# Altium schematic sheet LPDDR4.SchDoc: LPDDR4
size A3; Date: Not used; ApprovedBy: Not used; CheckedBy: Not used; Author: Not used; CompanyName: STMicroelectronics; DrawnBy: Not used; Engineer: Not used; Organization: Not used; Address1: Not used; Address2: Not used; Address3: Not used; Address4: Not used; DocumentNumber: Not used; Revision: Not used; SheetNumber: 6; SheetTotal: 7; CurrentTime: Not used; CurrentDate: Not used; Time: Not used; DocumentFullPathAndName: Not used; DocumentName: Not used; ModifiedDate: Not used; ImagePath: Not used; ProjectName: Not used; Application_BuildNumber: Not used
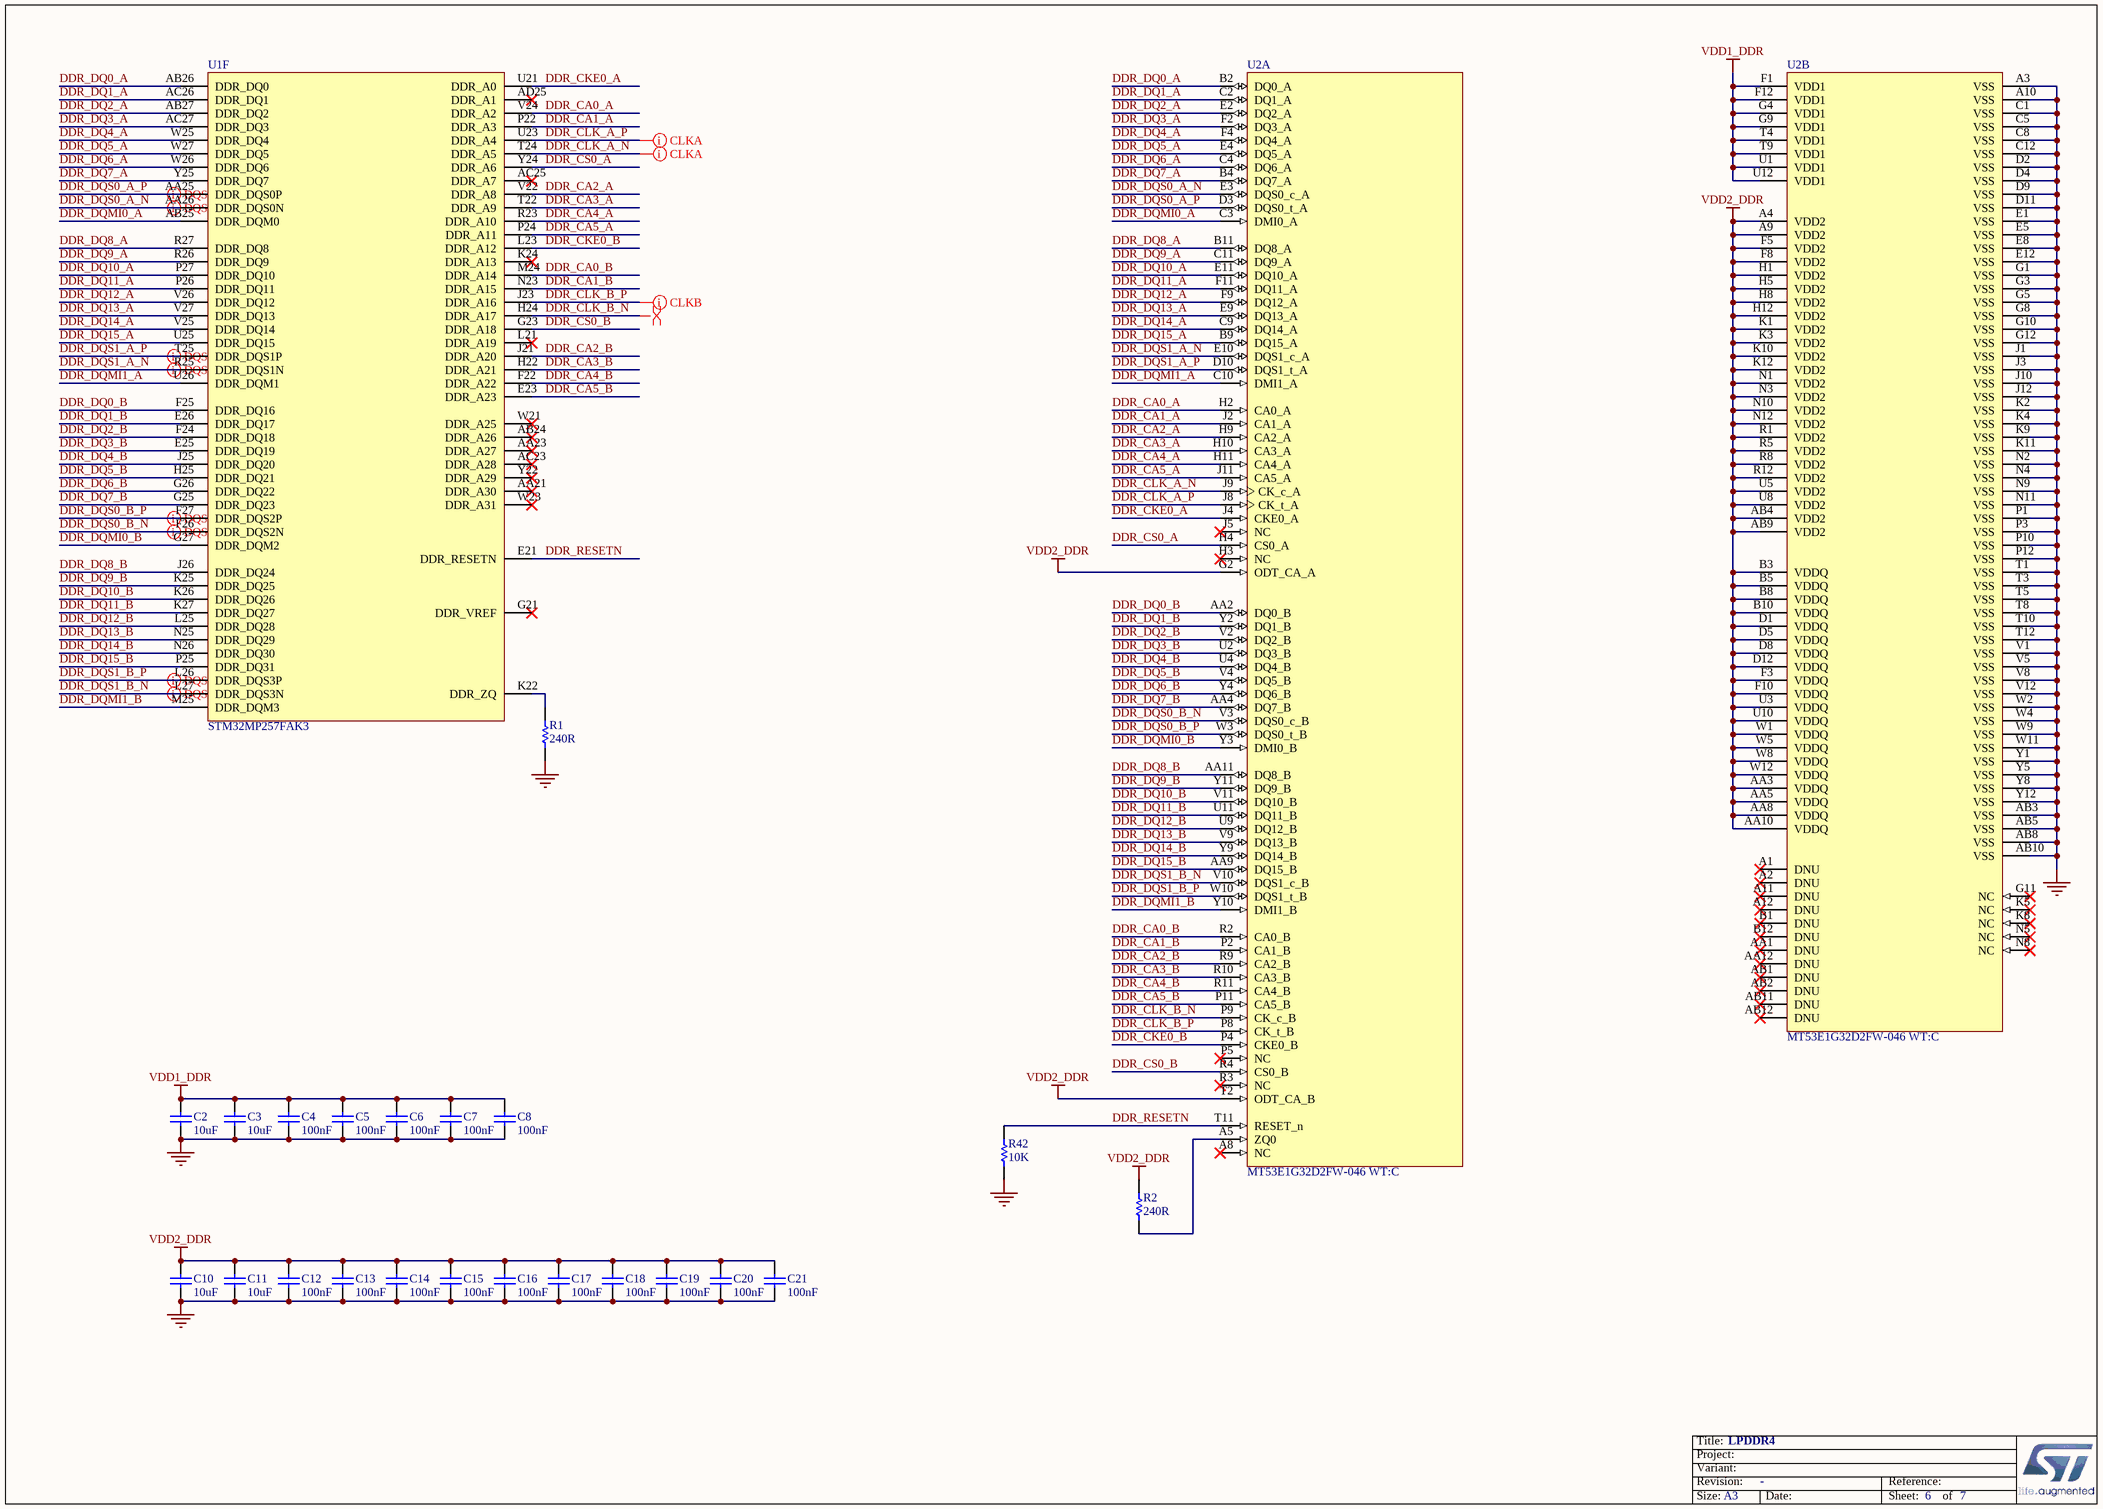
[diagram p0: LPDDR4.SchDoc]

## Parts
C2  value 10uF  [C0603]  (hidden comment: Capacitor)
C3  value 10uF  [C0603]  (hidden comment: Capacitor)
C4  100nF  [C0402]
C5  100nF  [C0402]
C6  100nF  [C0402]
C7  100nF  [C0402]
C8  100nF  [C0402]
C10  value 10uF  [C0603]  (hidden comment: Capacitor)
C11  value 10uF  [C0603]  (hidden comment: Capacitor)
C12  100nF  [C0402]
C13  100nF  [C0402]
C14  100nF  [C0402]
C15  100nF  [C0402]
C16  100nF  [C0402]
C17  100nF  [C0402]
C18  100nF  [C0402]
C19  100nF  [C0402]
C20  100nF  [C0402]
C21  100nF  [C0402]
R1  value 240R  [R0201_H0P23]  (hidden comment: Resistor)
R2  value 240R  [R0201_H0P23]  (hidden comment: Resistor)
R42  value 10K  [R0402]  (hidden comment: Resistor)
U1  STM32MP257FAK3  [ICC_TFBGA424_14X14_P050_H1P20_CODE-B0A2]  (part F of 9)
U2  MT53E1G32D2FW-046 WT:C  [ICC_TFBGA200_10X14P5_P080_H1P05_PS0P3]  (parts A,B of 2)

## Nets
GND: C2.1 C3.1 C4.2 C5.2 C6.2 C7.2 C8.2 C10.1 C11.1 C12.2 C13.2 C14.2 C15.2 C16.2 C17.2 C18.2 C19.2 C20.2 C21.2 R1.1 R42.1 U2.A3(VSS) U2.A10(VSS) U2.AB3(VSS) U2.AB5(VSS) U2.AB8(VSS) U2.AB10(VSS) U2.C1(VSS) U2.C5(VSS) U2.C8(VSS) U2.C12(VSS) U2.D2(VSS) U2.D4(VSS) U2.D9(VSS) U2.D11(VSS) U2.E1(VSS) U2.E5(VSS) U2.E8(VSS) U2.E12(VSS) U2.G1(VSS) U2.G3(VSS) U2.G5(VSS) U2.G8(VSS) U2.G10(VSS) U2.G12(VSS) U2.J1(VSS) U2.J3(VSS) U2.J10(VSS) U2.J12(VSS) U2.K2(VSS) U2.K4(VSS) U2.K9(VSS) U2.K11(VSS) U2.N2(VSS) U2.N4(VSS) U2.N9(VSS) U2.N11(VSS) U2.P1(VSS) U2.P3(VSS) U2.P10(VSS) U2.P12(VSS) U2.T1(VSS) U2.T3(VSS) U2.T5(VSS) U2.T8(VSS) U2.T10(VSS) U2.T12(VSS) U2.V1(VSS) U2.V5(VSS) U2.V8(VSS) U2.V12(VSS) U2.W2(VSS) U2.W4(VSS) U2.W9(VSS) U2.W11(VSS) U2.Y1(VSS) U2.Y5(VSS) U2.Y8(VSS) U2.Y12(VSS)
VDD1_DDR: C2.2 C3.2 C4.1 C5.1 C6.1 C7.1 C8.1 U2.F1(VDD1) U2.F12(VDD1) U2.G4(VDD1) U2.G9(VDD1) U2.T4(VDD1) U2.T9(VDD1) U2.U1(VDD1) U2.U12(VDD1)
VDD2_DDR: C10.2 C11.2 C12.1 C13.1 C14.1 C15.1 C16.1 C17.1 C18.1 C19.1 C20.1 C21.1 R2.2 U2.A4(VDD2) U2.A9(VDD2) U2.AA3(VDDQ) U2.AA5(VDDQ) U2.AA8(VDDQ) U2.AA10(VDDQ) U2.AB4(VDD2) U2.AB9(VDD2) U2.B3(VDDQ) U2.B5(VDDQ) U2.B8(VDDQ) U2.B10(VDDQ) U2.D1(VDDQ) U2.D5(VDDQ) U2.D8(VDDQ) U2.D12(VDDQ) U2.F3(VDDQ) U2.F5(VDD2) U2.F8(VDD2) U2.F10(VDDQ) U2.G2(ODT_CA_A) U2.H1(VDD2) U2.H5(VDD2) U2.H8(VDD2) U2.H12(VDD2) U2.K1(VDD2) U2.K3(VDD2) U2.K10(VDD2) U2.K12(VDD2) U2.N1(VDD2) U2.N3(VDD2) U2.N10(VDD2) U2.N12(VDD2) U2.R1(VDD2) U2.R5(VDD2) U2.R8(VDD2) U2.R12(VDD2) U2.T2(ODT_CA_B) U2.U3(VDDQ) U2.U5(VDD2) U2.U8(VDD2) U2.U10(VDDQ) U2.W1(VDDQ) U2.W5(VDDQ) U2.W8(VDDQ) U2.W12(VDDQ)
DDR_CA0_A: U1.V24(DDR_A2) U2.H2(CA0_A)
DDR_CA0_B: U1.M24(DDR_A14) U2.R2(CA0_B)
DDR_CA1_A: U1.P22(DDR_A3) U2.J2(CA1_A)
DDR_CA1_B: U1.N23(DDR_A15) U2.P2(CA1_B)
DDR_CA2_A: U1.V22(DDR_A8) U2.H9(CA2_A)
DDR_CA2_B: U1.J21(DDR_A20) U2.R9(CA2_B)
DDR_CA3_A: U1.T22(DDR_A9) U2.H10(CA3_A)
DDR_CA3_B: U1.H22(DDR_A21) U2.R10(CA3_B)
DDR_CA4_A: U1.R23(DDR_A10) U2.H11(CA4_A)
DDR_CA4_B: U1.F22(DDR_A22) U2.R11(CA4_B)
DDR_CA5_A: U1.P24(DDR_A11) U2.J11(CA5_A)
DDR_CA5_B: U1.E23(DDR_A23) U2.P11(CA5_B)
DDR_CKE0_A: U1.U21(DDR_A0) U2.J4(CKE0_A)
DDR_CKE0_B: U1.L23(DDR_A12) U2.P4(CKE0_B)
DDR_CLK_A_N: U1.T24(DDR_A5) U2.J9(CK_c_A)
DDR_CLK_A_P: U1.U23(DDR_A4) U2.J8(CK_t_A)
DDR_CLK_B_N: U1.H24(DDR_A17) U2.P9(CK_c_B)
DDR_CLK_B_P: U1.J23(DDR_A16) U2.P8(CK_t_B)
DDR_CS0_A: U1.Y24(DDR_A6) U2.H4(CS0_A)
DDR_CS0_B: U1.G23(DDR_A18) U2.R4(CS0_B)
DDR_DQ0_A: U1.AB26(DDR_DQ0) U2.B2(DQ0_A)
DDR_DQ0_B: U1.F25(DDR_DQ16) U2.AA2(DQ0_B)
DDR_DQ1_A: U1.AC26(DDR_DQ1) U2.C2(DQ1_A)
DDR_DQ1_B: U1.E26(DDR_DQ17) U2.Y2(DQ1_B)
DDR_DQ2_A: U1.AB27(DDR_DQ2) U2.E2(DQ2_A)
DDR_DQ2_B: U1.F24(DDR_DQ18) U2.V2(DQ2_B)
DDR_DQ3_A: U1.AC27(DDR_DQ3) U2.F2(DQ3_A)
DDR_DQ3_B: U1.E25(DDR_DQ19) U2.U2(DQ3_B)
DDR_DQ4_A: U1.W25(DDR_DQ4) U2.F4(DQ4_A)
DDR_DQ4_B: U1.J25(DDR_DQ20) U2.U4(DQ4_B)
DDR_DQ5_A: U1.W27(DDR_DQ5) U2.E4(DQ5_A)
DDR_DQ5_B: U1.H25(DDR_DQ21) U2.V4(DQ5_B)
DDR_DQ6_A: U1.W26(DDR_DQ6) U2.C4(DQ6_A)
DDR_DQ6_B: U1.G26(DDR_DQ22) U2.Y4(DQ6_B)
DDR_DQ7_A: U1.Y25(DDR_DQ7) U2.B4(DQ7_A)
DDR_DQ7_B: U1.G25(DDR_DQ23) U2.AA4(DQ7_B)
DDR_DQ8_A: U1.R27(DDR_DQ8) U2.B11(DQ8_A)
DDR_DQ8_B: U1.J26(DDR_DQ24) U2.AA11(DQ8_B)
DDR_DQ9_A: U1.R26(DDR_DQ9) U2.C11(DQ9_A)
DDR_DQ9_B: U1.K25(DDR_DQ25) U2.Y11(DQ9_B)
DDR_DQ10_A: U1.P27(DDR_DQ10) U2.E11(DQ10_A)
DDR_DQ10_B: U1.K26(DDR_DQ26) U2.V11(DQ10_B)
DDR_DQ11_A: U1.P26(DDR_DQ11) U2.F11(DQ11_A)
DDR_DQ11_B: U1.K27(DDR_DQ27) U2.U11(DQ11_B)
DDR_DQ12_A: U1.V26(DDR_DQ12) U2.F9(DQ12_A)
DDR_DQ12_B: U1.L25(DDR_DQ28) U2.U9(DQ12_B)
DDR_DQ13_A: U1.V27(DDR_DQ13) U2.E9(DQ13_A)
DDR_DQ13_B: U1.N25(DDR_DQ29) U2.V9(DQ13_B)
DDR_DQ14_A: U1.V25(DDR_DQ14) U2.C9(DQ14_A)
DDR_DQ14_B: U1.N26(DDR_DQ30) U2.Y9(DQ14_B)
DDR_DQ15_A: U1.U25(DDR_DQ15) U2.B9(DQ15_A)
DDR_DQ15_B: U1.P25(DDR_DQ31) U2.AA9(DQ15_B)
DDR_DQMI0_A: U1.AB25(DDR_DQM0) U2.C3(DMI0_A)
DDR_DQMI0_B: U1.G27(DDR_DQM2) U2.Y3(DMI0_B)
DDR_DQMI1_A: U1.U26(DDR_DQM1) U2.C10(DMI1_A)
DDR_DQMI1_B: U1.M25(DDR_DQM3) U2.Y10(DMI1_B)
DDR_DQS0_A_N: U1.AA26(DDR_DQS0N) U2.E3(DQS0_c_A)
DDR_DQS0_A_P: U1.AA25(DDR_DQS0P) U2.D3(DQS0_t_A)
DDR_DQS0_B_N: U1.F26(DDR_DQS2N) U2.V3(DQS0_c_B)
DDR_DQS0_B_P: U1.F27(DDR_DQS2P) U2.W3(DQS0_t_B)
DDR_DQS1_A_N: U1.R25(DDR_DQS1N) U2.E10(DQS1_c_A)
DDR_DQS1_A_P: U1.T25(DDR_DQS1P) U2.D10(DQS1_t_A)
DDR_DQS1_B_N: U1.L27(DDR_DQS3N) U2.V10(DQS1_c_B)
DDR_DQS1_B_P: U1.L26(DDR_DQS3P) U2.W10(DQS1_t_B)
DDR_RESETN: R42.2 U1.E21(DDR_RESETN) U2.T11(RESET_n)
NetR1_2: R1.2 U1.K22(DDR_ZQ)
NetR2_1: R2.1 U2.A5(ZQ0)

Not connected (* = marked no-connect by the designer): U1 AA21(DDR_A30)* AA23(DDR_A27)* AB24(DDR_A26)* AC23(DDR_A28)* AC25(DDR_A7)* AD25(DDR_A1)* G21(DDR_VREF)* K24(DDR_A13)* L21(DDR_A19)* W21(DDR_A25)* W23(DDR_A31)* Y22(DDR_A29)*; U2 A1(DNU)* A2(DNU)* A8(NC)* A11(DNU)* A12(DNU)* AA1(DNU)* AA12(DNU)* AB1(DNU)* AB2(DNU)* AB11(DNU)* AB12(DNU)* B1(DNU)* B12(DNU)* G11(NC)* H3(NC)* J5(NC)* K5(NC)* K8(NC)* N5(NC)* N8(NC)* P5(NC)* R3(NC)*

## Layout directives
differential pair: DDR_CLK_A_N, DDR_CLK_A_P, DDR_CLK_B_N, DDR_CLK_B_P, DDR_DQS0_A_N, DDR_DQS0_A_P, DDR_DQS0_B_N, DDR_DQS0_B_P, DDR_DQS1_A_N, DDR_DQS1_A_P, DDR_DQS1_B_N, DDR_DQS1_B_P

## Notes on the sheet
- Title:
- Project:
- Size:
- Revision:
- Variant:
- A3
- -
- Date:
- Reference:
- Sheet:
- of

## Library data of the parts
C2 C3 C10 C11 = MCD-01341: Capacitor, MLCC, 10uF, 6V3, X5R, 20%, 0603, T=0,8mm; Manufacturer_Part_Number: GRM188R60J106ME47D; Manufacturer: MURATA; Alternate_Manufacturer_Part_Number: GRM188R60J106ME84D; Part_Preference: Recommended; ECCN_US: EAR99; ECCN_EU: NEC; Provided_By: SUBCO; Component_Country_Of_Origin: Japan; ID: 3441; ShowFields: YES; Internal_Part_Number: MCD-01341; Status: Released; Part_Type: Capacitor; Alternate_Manufacturer: MURATA; Package: 0603; ComponentLink1Description: Datasheet; ComponentLink1URL: http://tunmcdsvn.tun.st.com/Component_Documentation_Library/Trunk/Capacitor/MURATA_GRM_Series; Order_Code_Digikey: 490-3896-1-ND; Order_Code_Farnell: 1735528; Order_Code_RS: N/A
C4-C8 C12-C21 = MCD-00006: Capacitor, MLCC, 100nF, 16V, X7R, +/-10%, 0402, T=0.5mm; Part_Preference: Recommended; Manufacturer: YAGEO; Manufacturer_Part_Number: CC0402KRX7R7BB104; Partial_Alternate_Internal_Part_Number: MCD-03299; Order_Code_RS: 616-9701; Component_Country_Of_Origin: China; Alternate_EMS: M; ShowFields: YES; ID: 2474; Value: 100nF; Internal_Part_Number: MCD-00006; Status: Released; Part_Type: Capacitor; Package: 0402; ComponentLink1URL: http://tunmcdsvn.tun.st.com/Component_Documentation_Library/Trunk/Capacitor/YAGEO_X7R_Series; Order_Code_Digikey: 311-1338-1-ND; Order_Code_Farnell: 9402047
R1 R2 = MCD-02253: Resistor, 240R, 0201, +/-1%, 1/20W; Part_Preference: Recommended; Manufacturer: YAGEO; Manufacturer_Part_Number: RC0201FR-07240RL; Component_Country_Of_Origin: China; ID: 4353; ShowFields: YES; Internal_Part_Number: MCD-02253; Status: Checked; Part_Type: Resistor; Alternate_Manufacturer: N/A; Alternate_Manufacturer_Part_Number: N/A; Package: 0201; ComponentLink1URL: http://tunmcdsvn.tun.st.com/Component_Datasheet_Library/Trunk/Resistors/Yageo_Resistor_RC0201-series; Order_Code_Digikey: YAG2528CT-ND; Order_Code_Farnell: N/A; Order_Code_RS: N/A
R42 = MCD-00053: Resistor, 10K, 0402, +/-1%, 1/16W; BMS_Part_Number: 9131590; Part_Preference: Recommended; Manufacturer: YAGEO; Manufacturer_Part_Number: RC0402FR-0710KL; Component_Country_Of_Origin: China; ID: 2539; ShowFields: YES; Internal_Part_Number: MCD-00053; Status: Released; Part_Type: Resistor; Alternate_Manufacturer: N/A; Alternate_Manufacturer_Part_Number: N/A; Package: 0402; ComponentLink1URL: http://tunmcdsvn.tun.st.com/Component_Documentation_Library/Trunk/Resistor/YAGEO_RC_L_Series; Order_Code_Digikey: 311-10.0KLRCT-ND; Order_Code_Farnell: 9239359; Order_Code_RS: N/A
U1 = MCD-03375: MPU , 2xCortex-A35@1.5GHz, Cortex-M33@400MHz, TFBGA 14x14, pitch 0.5, 808 KB SRAM, With Crypto; Part_Type: IC; Part_Preference: Recommended; Manufacturer: STMICROELECTRONICS; Component_Country_Of_Origin: Unknown; ShowFields: YES; ID: 5491; Internal_Part_Number: MCD-03375; Value: STM32MP257FAK3; Status: Checked; Manufacturer_Part_Number: STM32MP257FAK3; Package: TFBGA; ComponentLink1URL: http://tunmcdsvn.tun.st.com/Component_Documentation_Library/Trunk/IC/STMICROELECTRONICS_STM32MP257FAK3; Order_Code_Digikey: N/A; Order_Code_Farnell: N/A; Order_Code_RS: N/A
U2 = MCD-04160: Memory, LPDDR4 SDRAM,1V8, 32Gbit, 2133MHz; Part_Type: IC; Part_Preference: Recommended; Manufacturer: MICRON; ShowFields: YES; ID: 6276; Internal_Part_Number: MCD-04160; Value: MT53E1G32D2FW-046 WT:C; Status: New; Manufacturer_Part_Number: MT53E1G32D2FW-046 WT:C; Package: TFBGA-200; ComponentLink1URL: http://tunmcdsvn.tun.st.com/Component_Documentation_Library/Trunk/IC/MICRON_MT53E1G32D2FW-046-WT-C; Order_Code_Digikey: 557-MT53E1G32D2FW-046WT:C-ND; Order_Code_Farnell: N/A; Order_Code_RS: N/A